# Altium schematic sheet FPGA.SchDoc
size A4
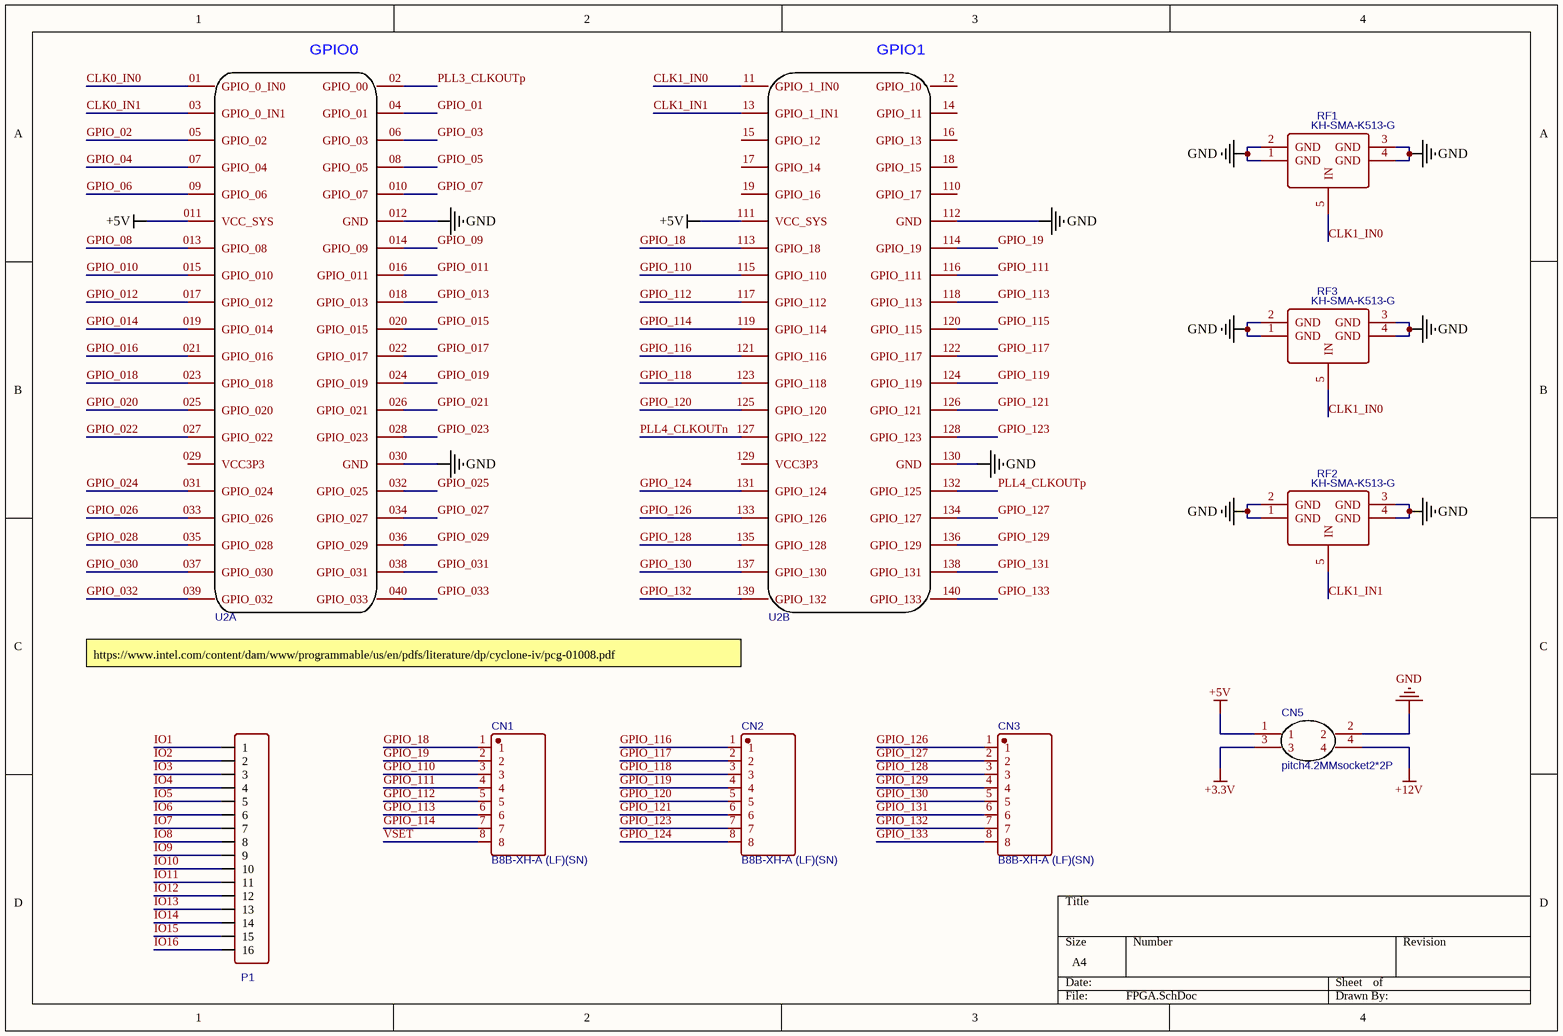
[diagram p0: FPGA.SchDoc]

## Parts
CN1  B8B-XH-A (LF)(SN)  [CONN-TH_B8B-XH-A (LF)(SN)]
CN2  B8B-XH-A (LF)(SN)  [CONN-TH_B8B-XH-A (LF)(SN)]
CN3  B8B-XH-A (LF)(SN)  [CONN-TH_B8B-XH-A (LF)(SN)]
CN5  pitch4.2MMsocket2*2P  [CONN-TH_HAA420A-4A]
P1  Header-Female-2.54_1x16  [HDR-TH_16P-P2.54-V]  (value not drawn)
RF1  KH-SMA-K513-G  [ANT-TH_KH-SMA-K513-G]
RF2  KH-SMA-K513-G  [ANT-TH_KH-SMA-K513-G]
RF3  KH-SMA-K513-G  [ANT-TH_KH-SMA-K513-G]
U2  DE0 NANO UPSIDE-DOWN PIN HEADERS COPY  [DE0-NANO UPSIDE DOWN]  (value not drawn)  (parts A,B of 2)

## Nets
+3.3V: CN5.3
+5V: CN5.1 U2.011(VCC_SYS) U2.111(VCC_SYS)
+12V: CN5.4
GND: CN5.2 RF1.1(GND) RF1.2(GND) RF1.3(GND) RF1.4(GND) RF2.1(GND) RF2.2(GND) RF2.3(GND) RF2.4(GND) RF3.1(GND) RF3.2(GND) RF3.3(GND) RF3.4(GND) U2.012(GND) U2.030(GND) U2.112(GND) U2.130(GND)
CLK0_IN0: U2.01(GPIO_0_IN0)
CLK0_IN1: U2.03(GPIO_0_IN1)
CLK1_IN0: RF1.5(IN) RF3.5(IN) U2.11(GPIO_1_IN0)
CLK1_IN1: RF2.5(IN) U2.13(GPIO_1_IN1)
GPIO_01: U2.04(GPIO_01)
GPIO_02: U2.05(GPIO_02)
GPIO_03: U2.06(GPIO_03)
GPIO_04: U2.07(GPIO_04)
GPIO_05: U2.08(GPIO_05)
GPIO_06: U2.09(GPIO_06)
GPIO_07: U2.010(GPIO_07)
GPIO_08: U2.013(GPIO_08)
GPIO_09: U2.014(GPIO_09)
GPIO_010: U2.015(GPIO_010)
GPIO_011: U2.016(GPIO_011)
GPIO_012: U2.017(GPIO_012)
GPIO_013: U2.018(GPIO_013)
GPIO_014: U2.019(GPIO_014)
GPIO_015: U2.020(GPIO_015)
GPIO_016: U2.021(GPIO_016)
GPIO_017: U2.022(GPIO_017)
GPIO_018: U2.023(GPIO_018)
GPIO_18: CN1.1 U2.113(GPIO_18)
GPIO_019: U2.024(GPIO_019)
GPIO_19: CN1.2 U2.114(GPIO_19)
GPIO_020: U2.025(GPIO_020)
GPIO_021: U2.026(GPIO_021)
GPIO_022: U2.027(GPIO_022)
GPIO_023: U2.028(GPIO_023)
GPIO_024: U2.031(GPIO_024)
GPIO_025: U2.032(GPIO_025)
GPIO_026: U2.033(GPIO_026)
GPIO_027: U2.034(GPIO_027)
GPIO_028: U2.035(GPIO_028)
GPIO_029: U2.036(GPIO_029)
GPIO_030: U2.037(GPIO_030)
GPIO_031: U2.038(GPIO_031)
GPIO_032: U2.039(GPIO_032)
GPIO_033: U2.040(GPIO_033)
GPIO_110: CN1.3 U2.115(GPIO_110)
GPIO_111: CN1.4 U2.116(GPIO_111)
GPIO_112: CN1.5 U2.117(GPIO_112)
GPIO_113: CN1.6 U2.118(GPIO_113)
GPIO_114: CN1.7 U2.119(GPIO_114)
GPIO_115: U2.120(GPIO_115)
GPIO_116: CN2.1 U2.121(GPIO_116)
GPIO_117: CN2.2 U2.122(GPIO_117)
GPIO_118: CN2.3 U2.123(GPIO_118)
GPIO_119: CN2.4 U2.124(GPIO_119)
GPIO_120: CN2.5 U2.125(GPIO_120)
GPIO_121: CN2.6 U2.126(GPIO_121)
GPIO_123: CN2.7 U2.128(GPIO_123)
GPIO_124: CN2.8 U2.131(GPIO_124)
GPIO_126: CN3.1 U2.133(GPIO_126)
GPIO_127: CN3.2 U2.134(GPIO_127)
GPIO_128: CN3.3 U2.135(GPIO_128)
GPIO_129: CN3.4 U2.136(GPIO_129)
GPIO_130: CN3.5 U2.137(GPIO_130)
GPIO_131: CN3.6 U2.138(GPIO_131)
GPIO_132: CN3.7 U2.139(GPIO_132)
GPIO_133: CN3.8 U2.140(GPIO_133)
IO1: P1.1
IO2: P1.2
IO3: P1.3
IO4: P1.4
IO5: P1.5
IO6: P1.6
IO7: P1.7
IO8: P1.8
IO9: P1.9
IO10: P1.10
IO11: P1.11
IO12: P1.12
IO13: P1.13
IO14: P1.14
IO15: P1.15
IO16: P1.16
PLL3_CLKOUTp: U2.02(GPIO_00)
PLL4_CLKOUTn: U2.127(GPIO_122)
PLL4_CLKOUTp: U2.132(GPIO_125)
VSET: CN1.8

Not connected (* = marked no-connect by the designer): U2 12(GPIO_10) 14(GPIO_11) 15(GPIO_12) 16(GPIO_13) 17(GPIO_14) 18(GPIO_15) 19(GPIO_16) 029(VCC3P3) 110(GPIO_17) 129(VCC3P3)

## Notes on the sheet
- (near U2) https://www.intel.com/content/dam/www/programmable/us/en/pdfs/literature/dp/cyclone-iv/pcg-01008.pdf
- (in symbol DE0 NANO UPSIDE-DOWN PIN HEADERS COPY, part A) GPIO0
- (in symbol DE0 NANO UPSIDE-DOWN PIN HEADERS COPY, part B) GPIO1

## Library data of the parts
CN1-CN3 = B8B-XH-A (LF)(SN): Manufacturer: JST Sales America; Contributor: LCSC; spicePre: C; spiceSymbolName: B8B-XH-A (LF)(SN); Supplier: LCSC; Supplier Part Number: C157972; Manufacture Part Number: B8B-XH-A (LF)(SN)
CN5 = pitch4.2MMsocket2*2P: Manufacturer: BOOMELE; image: //image.lceda.cn/szlcsc/C24697.jpg; spicePre: C; spiceSymbolName: pitch4.2MMsocket2*2P; Supplier: LCSC; Manufacture Part Number: pitch4.2MMsocket2*2P; Supplier Part Number: C24697
P1 = Header-Female-2.54_1x16: Manufacturer: BOOMELE; Manufacture Part Number: Female header1*16P pitch 2.54mm; image: //image.lceda.cn/szlcsc/C66987.jpg; spicePre: P; spiceSymbolName: Header-Female-2.54_1x16; Supplier: LCSC; Supplier Part Number: C66987
RF1-RF3 = KH-SMA-K513-G: Manufacturer: Shenzhen Kinghelm Elec; Contributor: LCSC; spicePre: R; spiceSymbolName: KH-SMA-K513-G; Supplier: LCSC; Supplier Part Number: C411575; Manufacture Part Number: KH-SMA-K513-G
U2 = DE0 NANO UPSIDE-DOWN PIN HEADERS COPY: subpart_no: 1; Contributor: cemasoniv; spicePre: U; spiceSymbolName: DE0 NANO UPSIDE-DOWN PIN HEADERS COPY